# EAGLE design przetwornice (EAGLE 5.06)
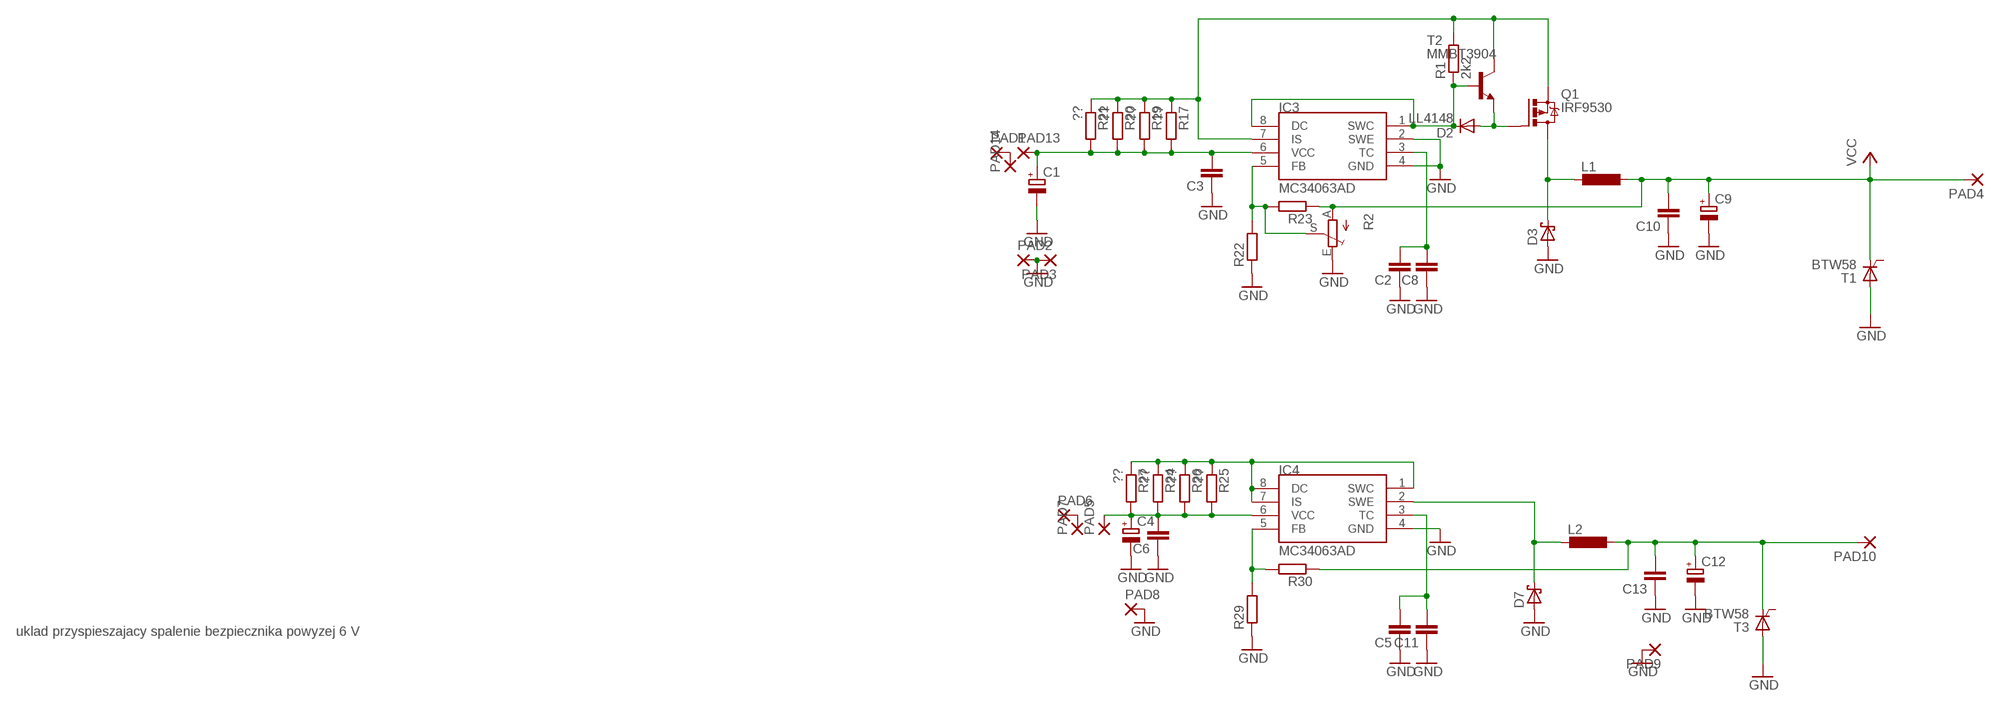
[diagram p0: schematic, sheet 1]

## Parts
C1  CPOL-EUE3.5-8  [E3,5-8]
C2  CAP  [0805]
C3  CAP  [0805]
C4  CPOL-EUE  [PANASONIC_E]
C5  CAP  [0805]
C6  CAP  [0805]
C8  CAP  [0805]
C9  CPOL-EUE3.5-10  [E3,5-10]
C10  CAP  [0805]
C11  CAP  [0805]
C12  CPOL-EUE  [PANASONIC_E]
C13  CAP  [0805]
D2  LL4148  DIODE-SOD110-W  [SOD110-W]
D3  SCHOTTKY-DIODESMC  [SMC]
D7  SCHOTTKY-DIODESMD  [SMB]
IC3  MC34063AD  [SOIC8]
IC4  MC34063AD  [SOIC8]
L1  DO3316P  [DO3316P]
L2  DO3316P  [DO3316P]
PAD1  2,15/1,0  [2,15/1,0]
PAD2  2,15/1,0  [2,15/1,0]
PAD3  2,15/1,0  [2,15/1,0]
PAD4  2,15/1,0  [2,15/1,0]
PAD5  2,54/0,8  [2,54/0,8]
PAD6  2,15/1,0  [2,15/1,0]
PAD7  2,54/0,8  [2,54/0,8]
PAD8  2,15/1,0  [2,15/1,0]
PAD9  2,15/1,0  [2,15/1,0]
PAD10  2,15/1,0  [2,15/1,0]
PAD13  2,54/0,8  [2,54/0,8]
PAD14  2,54/0,8  [2,54/0,8]
Q1  IRF9530  [TO220BV]
R1  2k2  RES0805  [0805]
R2  TRIM_EU-B64Y  [B64Y]
R17  ??  R-EU_R1206  [R1206]
R19  ??  R-EU_R1206  [R1206]
R20  ??  R-EU_R1206  [R1206]
R21  ??  R-EU_R1206  [R1206]
R22  RES0805  [0805]
R23  RES0805  [0805]
R24  ??  R-EU_R1206  [R1206]
R25  ??  R-EU_R1206  [R1206]
R26  ??  R-EU_R1206  [R1206]
R27  ??  R-EU_R1206  [R1206]
R29  RES0805  [0805]
R30  RES0805  [0805]
T1  BTW58  [TO220CS]
T2  MMBT3904  BC817-16-NPN-SOT23-BEC  [SOT23-BEC]
T3  BTW58  [TO220CS]

## Nets
CHOKE1: D3.C L1.1 Q1.D
CHOKE2: D7.C IC4.2(SWE) L2.1
GND: C1.- C2.1 C3.1 C4.- C5.1 C6.1 C8.1 C9.- C10.1 C11.1 C12.- C13.1 D3.A D7.A IC3.2(SWE) IC3.4(GND) IC4.4(GND) PAD2.1(P) PAD3.1(P) PAD8.1(P) PAD9.1(P) R2.E R22.1 R29.1 T1.A T3.A
N$1: D2.C IC3.1(SWC) IC3.8(DC) R1.1 T2.B
N$2: C1.+ C3.2 IC3.6(VCC) PAD13.1(P) R17.2 R19.2 R20.2 R21.2
N$3: C4.+ C6.2 IC4.6(VCC) PAD5.1(P) R24.2 R25.2 R26.2 R27.2
N$5: PAD1.1(P) PAD14.1(P)
N$7: PAD6.1(P) PAD7.1(P)
N$16: IC3.7(IS) Q1.S R1.2 R17.1 R19.1 R20.1 R21.1 T2.C
N$23: IC3.5(FB) R2.S R22.2 R23.2
N$29: C2.2 C8.2 IC3.3(TC)
N$30: IC4.1(SWC) IC4.7(IS) IC4.8(DC) R24.1 R25.1 R26.1 R27.1
N$31: IC4.5(FB) R29.2 R30.2
N$32: D2.A Q1.G T2.E
N$44: C5.2 C11.2 IC4.3(TC)
OUT2: C12.+ C13.2 L2.2 PAD10.1(P) R30.1 T3.C
VCC: C9.+ C10.2 L1.2 PAD4.1(P) R2.A R23.1 T1.C
Unconnected: T1.G T3.G

## Notes on the sheet
- uklad przyspieszajacy spalenie bezpiecznika powyzej 6 V

## Library data of the parts
C1 C4 C9 C12 = rcl:CPOL-EU: POLARIZED CAPACITOR, European symbol
C2 C3 C5 C6 C8 C10 C11 C13 = barobot:CAP
D2 = diode:DIODE-: DIODE
D3 D7 = diode:SCHOTTKY-DIODE: Schottky Diode
IC3 IC4 = mc34063:MC34063
L1 L2 = inductor-coilcraft:DO3316P: COILCRAFT
PAD1-PAD4 PAD6 PAD8-PAD10 = wirepad:2,15/1,0: THROUGH-HOLE PAD
PAD5 PAD7 PAD13 PAD14 = wirepad:2,54/0,8: THROUGH-HOLE PAD
Q1 = transistor-power:IRF9530: P-CHANNEL HEXFET POWER-MOS-FET Source: http://www.irf.com/product-info/datasheets/data/irf9530.pdf
R1 R22 R23 R29 R30 = barobot:RES
R2 = pot:TRIM_EU-: POTENTIOMETER
R17 R19-R21 R24-R27 = resistor:R-EU_: RESISTOR, European symbol
T1 T3 = triac:BTW58: THYRISTOR
T2 = transistor:*-NPN-: NPN Transistror BF959 corrected 2008.03.06

## Board
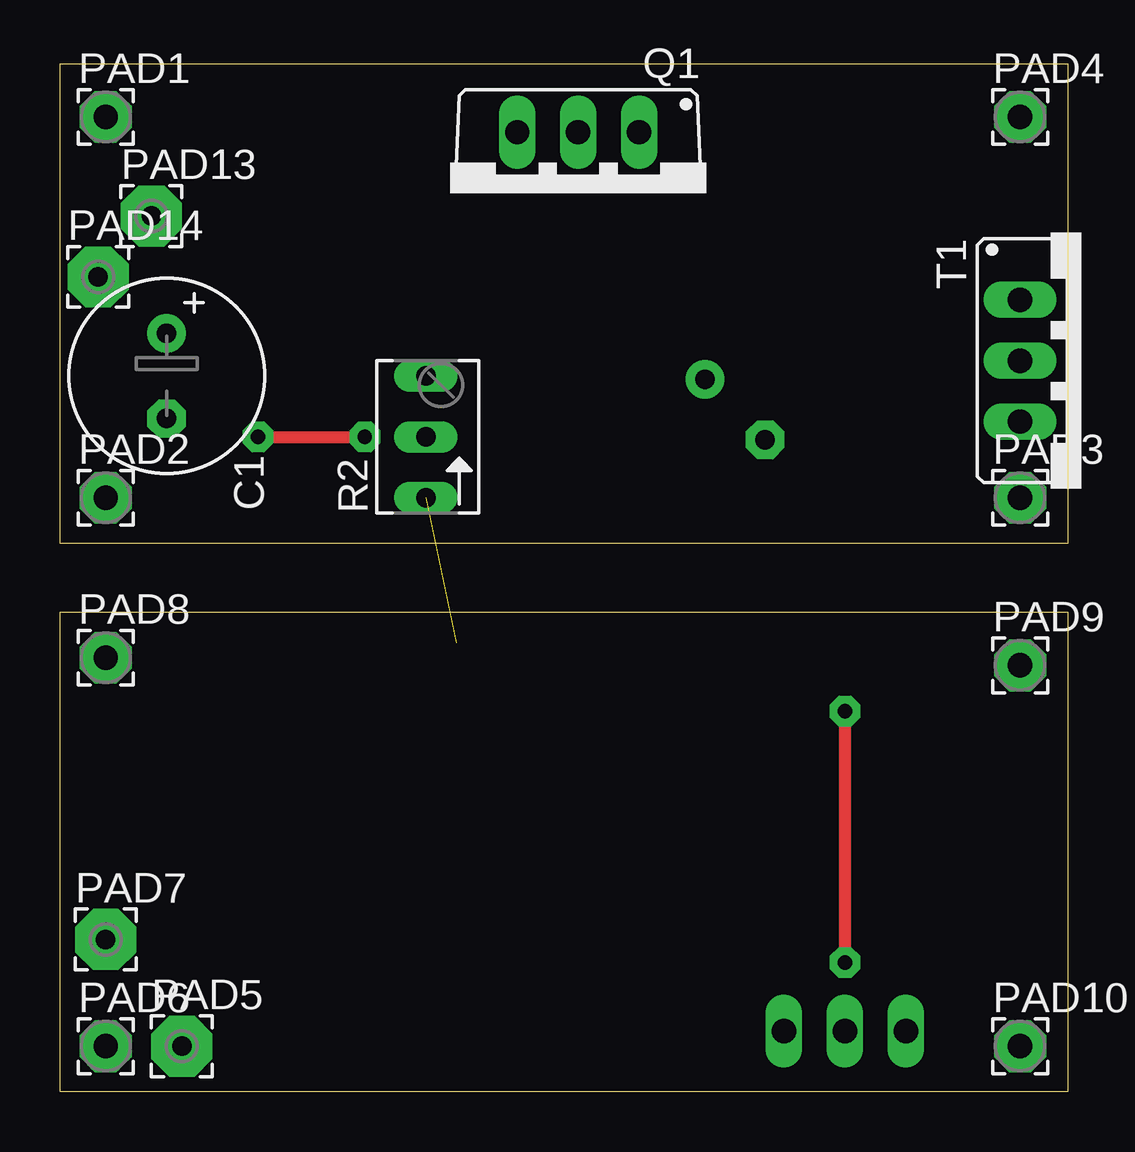
[diagram p1: board, top side]
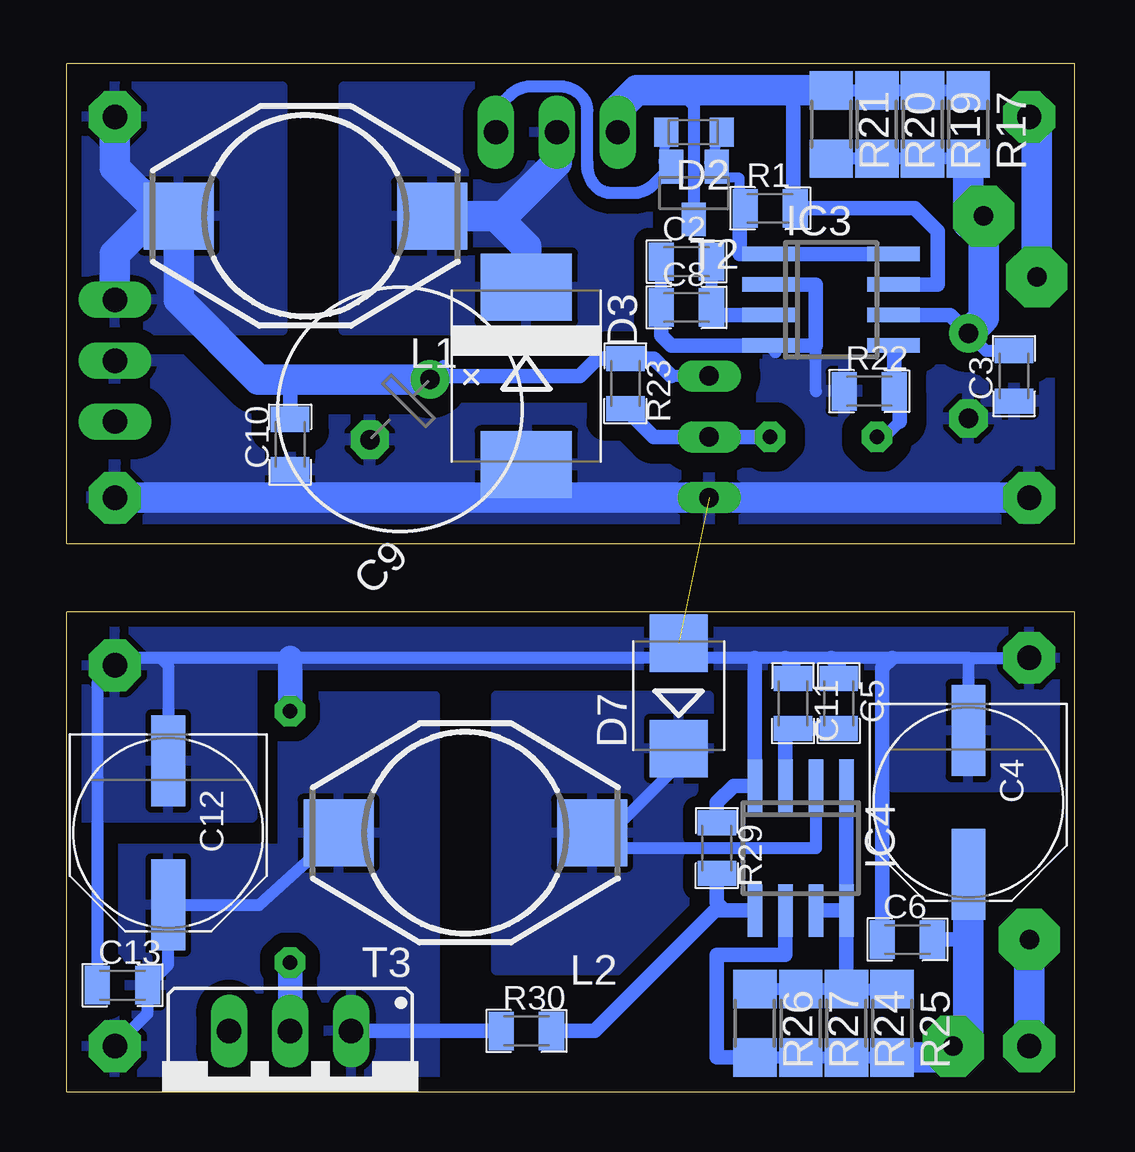
[diagram p2: board, bottom side, seen from below]

Size 42 x 42.86 mm. Coordinates in mm from the lower left corner, seen from the top.
Outline: 0,22.86 0,42.86 42,42.86 42,22.86 0,22.86
Outline: 0,0 0,20 42,20 42,0 0,0
Copper layers (1*16): Top 0.035mm / dielectric 1.5mm / Bottom 0.035mm
Design rules "default *": minimum track width 10mil, minimum drill 0.5mm, track to track 8mil, track to pad 8mil, pad to pad 8mil, via to via 8mil, smd to smd 8mil, copper to edge 20mil, drill to drill 8mil, minimum pad ring 10mil, minimum via ring 8mil, stop-mask expansion 4mil, vias tented up to drill 0mil, thermal gap 10mil

### Footprints (pad centres in the part's own frame; a part is rotated, then mirrored left to right if it is on the bottom)
E3,5-8 = drill 0.813 pad 1.6 round: + -1.778,0 | drill 0.813 pad 1.6 octagon: - 1.778,0
0805 = smd 1.044 x 1.6: 1 -1.048,0; 2 1.048,0
PANASONIC_E = smd 3.8 x 1.4: + 3,0; - -3,0
E3,5-10 = drill 0.813 pad 1.6 round: + -1.778,0 | drill 0.813 pad 1.6 octagon: - 1.778,0
SOD110-W = smd 1 x 1.2: A 1.15,0; C -1.15,0
SMC = smd 2.8 x 3.8: A 3.7,0; C -3.7,0
SMB = smd 2.4 x 2.4: A 2.2,0; C -2.2,0
SOIC8 = smd 0.6 x 2.2: 1 -1.905,-2.6; 2 -0.635,-2.6; 3 0.635,-2.6; 4 1.905,-2.6; 5 1.905,2.6; 6 0.635,2.6; 7 -0.635,2.6; 8 -1.905,2.6
DO3316P = smd 2.92 x 2.79: 1 -5.28,0; 2 5.28,0
2,15/1,0 = drill 1.016 pad 2.159 octagon: 1 0,0
2,54/0,8 = drill 0.813 pad 2.54 octagon: 1 0,0
TO220BV = drill 1.016 long: D 0,-2.54; G -2.54,-2.54; S 2.54,-2.54
B64Y = drill 0.813 long: A 2.54,0; E -2.54,0; S 0,0
R1206 = smd 1.6 x 1.803: 1 -1.422,0; 2 1.422,0
TO220CS = drill 1.016 long: A 0,-2.54; C -2.54,-2.54; G 2.54,-2.54
SOT23-BEC = smd 1 x 1.4: B -0.95,-1.1; C 0,1.1; E 0.95,-1.1

### Placement (x,y rotation side)
C1  4.45,29.84 270 top
C2  16.19,34.61 0 bottom
C3  2.54,29.84 90 bottom
C4  4.45,12.06 270 bottom
C5  9.84,16.19 270 bottom
C6  6.99,6.35 0 bottom
C8  16.19,32.7 0 bottom
C9  28.13,28.44 225 bottom
C10  32.7,26.99 90 bottom
C11  11.75,16.19 270 bottom
C12  37.78,10.79 270 bottom
C13  39.69,4.45 0 bottom
D2  15.88,40 180 bottom
D3  22.86,29.84 270 bottom
D7  16.51,16.51 90 bottom
IC3  10.16,33.02 270 bottom
IC4  11.43,10.16 180 bottom
L1  32.07,36.51 180 bottom
L2  25.4,10.79 180 bottom
PAD1  1.91,40.64 0 top
PAD2  1.91,24.77 0 top
PAD3  40.01,24.77 0 top
PAD4  40.01,40.64 0 top
PAD5  5.08,1.91 0 top
PAD6  1.91,1.91 0 top
PAD7  1.91,6.35 0 top
PAD8  1.91,18.1 0 top
PAD9  40.01,17.78 0 top
PAD10  40.01,1.91 0 top
PAD13  3.81,36.51 0 top
PAD14  1.59,33.97 0 top
Q1  21.59,37.47 180 top
R1  12.7,36.83 0 bottom
R2  15.24,27.3 90 top
R17  4.45,40.32 270 bottom
R19  6.35,40.32 270 bottom
R20  8.26,40.32 270 bottom
R21  10.16,40.32 270 bottom
R22  8.57,29.21 0 bottom
R23  18.73,29.53 270 bottom
R24  9.53,2.86 270 bottom
R25  7.62,2.86 270 bottom
R26  13.34,2.86 270 bottom
R27  11.43,2.86 270 bottom
R29  14.92,10.16 270 bottom
R30  22.86,2.54 0 bottom
T1  42.55,30.48 270 top
T2  15.88,37.47 180 bottom
T3  32.7,0 180 bottom

### Tracks (layer width: path | path; a pad name or v marks a point on that pad's centre or on a via)
CHOKE1
  Bottom 1.27: Q1.D 21.59,38.73 23.81,36.51 24.13,36.51 | 24.13,36.51 L1.1 | D3.C 22.86,35.24 24.13,36.51
  pour Bottom (isolate 0.61): 17.78,41.91 30.48,41.91 30.48,31.75 17.78,31.75
CHOKE2
  Bottom 0.508: IC4.2 10.79,10.16 19.05,10.16 19.05,11.11 | D7.C 16.51,13.65 19.05,11.11 | 19.05,11.11 L2.1
  pour Bottom (isolate 0.61): 15.24,16.51 24.13,16.51 24.13,5.08 15.24,5.08
GND  (via drill 0.6 pad 1.27)  (1 unrouted)
  Top 0.508: v32.7,15.88 v32.7,5.4
  Bottom 0.508: IC3.4 12.48,30.83 | C8.1 C2.1 | 31.43,24.77 C10.1 | 10.79,29.21 10.79,31.12 | 4.45,18.1 PAD8.1 | 4.45,18.1 7.62,18.1 10.16,18.1 12.06,18.1 13.34,18.1 16.19,18.1 | 16.19,18.1 32.7,18.1 38.1,18.1 | 38.1,18.1 39.69,18.1 PAD9.1 40.73,17.05 C13.1 | D7.A 16.19,18.39 16.19,18.1 | 4.45,18.1 C4.- | C12.- 37.78,17.78 38.1,18.1
  Bottom 0.61: IC3.2 10.79,33.66 10.79,31.12 IC3.4 16.83,31.12 17.24,31.53 C8.1 | R29.1 14.92,12.06 14.23,12.76 IC4.4 13.34,18.1 | C6.1 8.03,17.68 7.62,18.1 | C11.1 11.75,17.78 12.06,18.1 | C5.1 9.84,17.78 10.16,18.1
  Bottom 1.016: v32.7,5.4 T3.A | 32.7,18.1 v32.7,15.88
  Bottom 1.27: PAD2.1 31.43,24.77 PAD3.1
  pour Bottom (isolate 0.813): 0,30.48 41.91,30.48 41.91,22.86 0,22.86
  pour Bottom (isolate 0.61): 0,20.32 0,12.7 7.62,12.7 7.62,17.78 34.29,17.78 34.29,11.43 41.91,11.43 41.91,20.32
N$1
  Bottom 0.406: T2.B 15.24,38.73 | T2.B 15.24,38.1 13.97,38.1 13.97,37.47 | 15.24,38.73 D2.C | T2.B 15.24,38.73
  Bottom 0.508: R1.1 13.75,37.24 13.97,37.47
  Bottom 0.61: IC3.8 IC3.1 13.97,34.92 13.97,37.47
N$2
  Bottom 0.508: C3.2 3.71,30.89 C1.+ | R17.2 R19.2 R20.2 R21.2
  Bottom 0.61: IC3.6 5.21,32.38 C1.+
  Bottom 1.27: 4.45,36.83 4.45,36.2 | 4.45,36.83 R17.2 | C1.+ 3.81,32.26 PAD13.1 4.13,36.83 4.45,36.83
N$3
  Bottom 0.508: R26.2 R27.2 R24.2 R25.2
  Bottom 0.61: IC4.6 12.06,5.71 14.92,5.71 14.92,1.44 R26.2 | 4.45,6.35 C6.2
  Bottom 1.27: C4.+ 4.45,6.35 4.45,2.54 PAD5.1 5.55,1.44 R25.2
N$5
  Bottom 1.27: PAD14.1 1.59,40.32 PAD1.1
N$7
  Bottom 1.27: PAD7.1 PAD6.1
N$16
  Bottom 0.508: R17.1 R19.1 R20.1 R21.1 | T2.C 15.88,41.11 16.51,41.74 | R1.2 11.65,37.37 11.75,37.47
  Bottom 0.61: IC3.7 5.71,33.66 5.71,35.88 6.67,36.83 R1.2 | 11.75,37.47 11.75,41.74
  Bottom 1.27: R21.1 11.75,41.74 16.51,41.74 18.26,41.74 19.05,40.96 Q1.S
N$23  (via drill 0.6 pad 1.27)
  Top 0.508: v8.26,27.3 v12.7,27.3
  Bottom 0.508: 7.3,30.86 IC3.5 7.53,31.08 | v8.26,27.3 7.94,27.3 7.3,27.94 | R22.2 7.3,28.99
  Bottom 0.61: v12.7,27.3 R2.S 17.56,27.3 R23.2 | 7.3,28.99 7.3,27.94 | R22.2 7.53,31.08
N$29
  Bottom 0.508: C2.2 C8.2 14.83,32.38
  Bottom 0.61: IC3.3 14.83,32.38
N$30
  Bottom 0.508: R25.1 R24.1 R27.1 R26.1
  Bottom 0.61: IC4.1 IC4.8 | IC4.8 IC4.7 | IC4.8 R24.1
N$31
  Bottom 0.61: 14.61,7.56 14.98,7.56 20,2.54 R30.2 | 14.61,7.56 IC4.5 | R29.2 14.92,7.88 14.61,7.56
N$32
  Bottom 0.406: T2.E 17.14,38.73 D2.A
  Bottom 0.508: Q1.G 24.13,40.96 23.55,41.54 arc45 22.65,41.91 21.48,41.91 arc45 20.58,41.54 arc45 20.32,40.9 20.32,38.73 20.32,38.63 arc-45 19.95,37.73 arc-45 19.31,37.47 18.41,37.47 arc-45 17.58,37.81 T2.E
N$44
  Bottom 0.61: IC4.3 12.06,14.83 C11.2 C5.2
OUT2
  Bottom 0.508: 30.16,10.59 L2.2 34,7.79 C12.+ 37.78,5.3 C13.2 38.64,3.27 PAD10.1
  Bottom 0.61: R30.1 T3.C
  pour Bottom (isolate 0.61): 26.67,16.51 26.67,0 41.91,0 41.91,10.16 33.02,10.16 33.02,16.51
VCC
  Bottom 0.508: 26.31,30.26 C9.+ 26.72,29.84 | R2.A 16.83,29.84
  Bottom 0.61: 32.7,29.7 C10.2 | 16.83,29.84 17.56,30.57 R23.1 19.91,30.57 20.64,29.84 26.72,29.84
  Bottom 1.27: 38.2,36.73 L1.2 37.35,33.02 34.03,29.7 32.7,29.7 C9.+ | 38.2,36.73 40.01,38.53 PAD4.1 | T1.C 40.01,34.92 38.2,36.73
  pour Bottom (isolate 0.61): 33.02,41.91 41.91,41.91 41.91,31.75 33.02,31.75